# Altium schematic sheet Cover.SchDoc
size A3; DocumentNumber: 1; SheetNumber: 1; SheetTotal: 5; ENG_APP_DATE: --/--/--; DSN_APP_DATE: --/--/--; CHK_APP_DATE: --/--/--
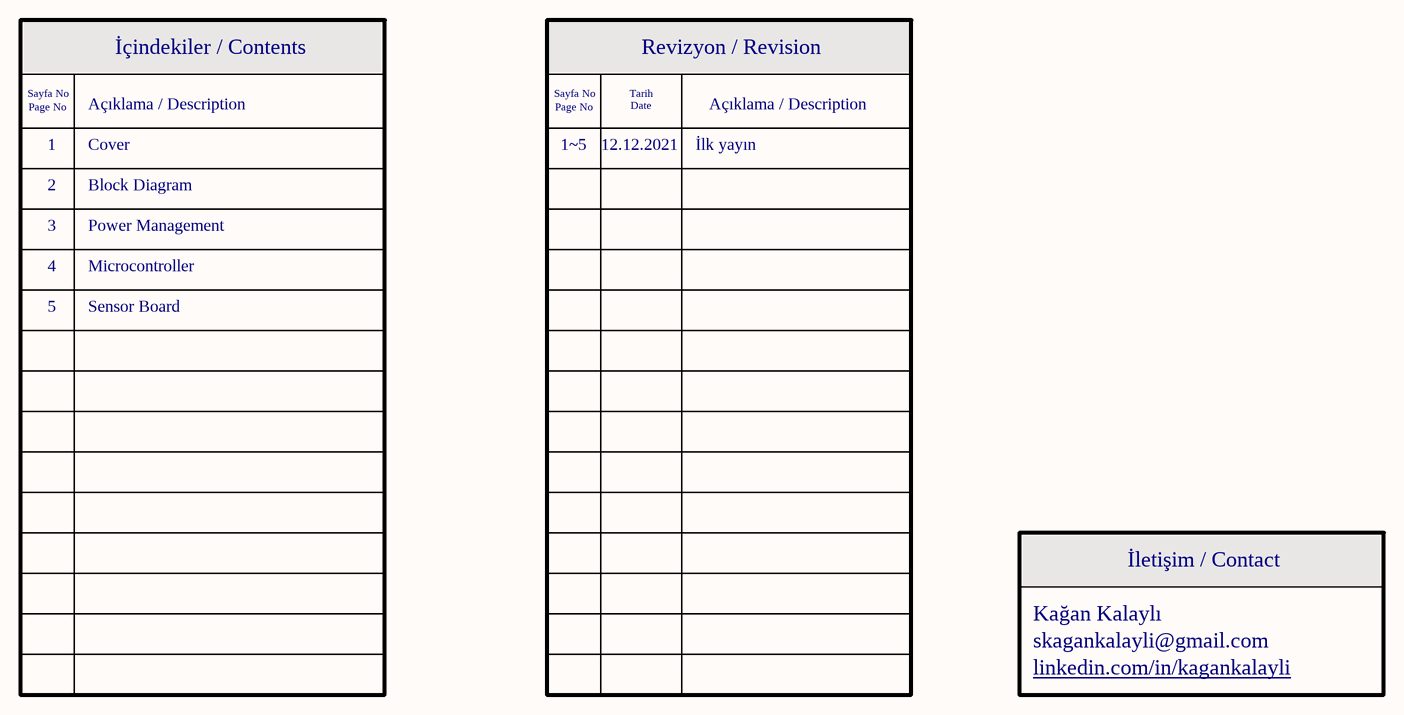
[diagram p0: Cover.SchDoc]

## Notes on the sheet
- Sayfa No
- Page No
- Açıklama / Description
- İçindekiler / Contents
- Tarih
- Date
- Revizyon / Revision
- 1
- Cover
- 1~5
- 12.12.2021
- İlk yayın
- 2
- 3
- Block Diagram
- Power Management
- 4
- 5
- Microcontroller
- Sensor Board
- İletişim / Contact
- Kağan Kalaylı
- skagankalayli@gmail.com
- linkedin.com/in/kagankalayli <http://linkedin.com/in/kagankalayli>
- DOSYA ADI / FILE NAME
- HAZIRLAYAN / PREPARED BY
- TANIM / DESCRIPTION
- YAYIN TARİHİ / REL. DATE
- KONTROL EDEN / CHECKED BY
- DEĞ. TARİHİ / CHANGE DATE
- ONAYLAYAN / APPROVED BY
- BÖLÜM / DEPARTMENT
- BOYUT / SIZE
- REVİZYON / REVISION
- SAYFA / SHEET
- /
- R&D- Hardware
- A3